# Altium schematic sheet JDY-23.SchDoc
size A4
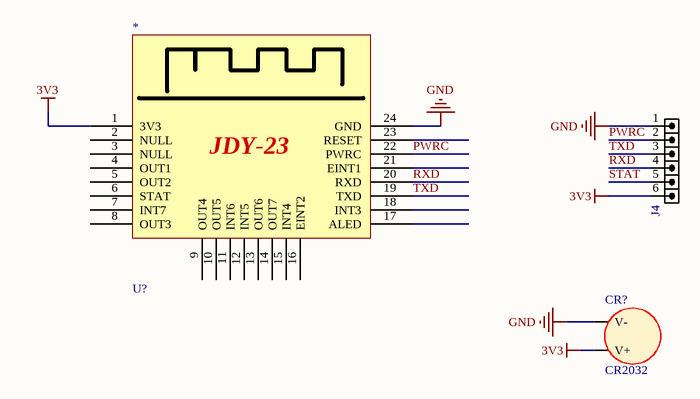
[diagram p0: JDY-23.SchDoc]

## Parts
*  U?  [JDY-23]
CR?  CR2032  [CR2032]
J4  HDR1X6  [HDRLP_M_1X6]  (value not drawn)

## Nets
3V3: *.1(3V3) CR?.1(V+) J4.6
GND: *.24(GND) CR?.2(V-) J4.1
PWRC: *.22(PWRC) J4.2
RXD: *.20(RXD) J4.4
STAT: J4.5
TXD: *.19(TXD) J4.3

Not connected (* = marked no-connect by the designer): * 2(NULL) 3(NULL) 4(OUT1) 5(OUT2) 6(STAT) 7(INT7) 8(OUT3) 9(OUT4) 10(OUT5) 11(INT6) 12(INT5) 13(OUT6) 14(OUT7) 15(INT4) 16(EINT2) 17(ALED) 18(INT3) 21(EINT1) 23(RESET)

## Library data of the parts
* = JDY-23
J4 = HDRLP_M_1X6: CONN, HEADER, Male, pitch: 2.54mm, 6POS; VALUE: HDRM6